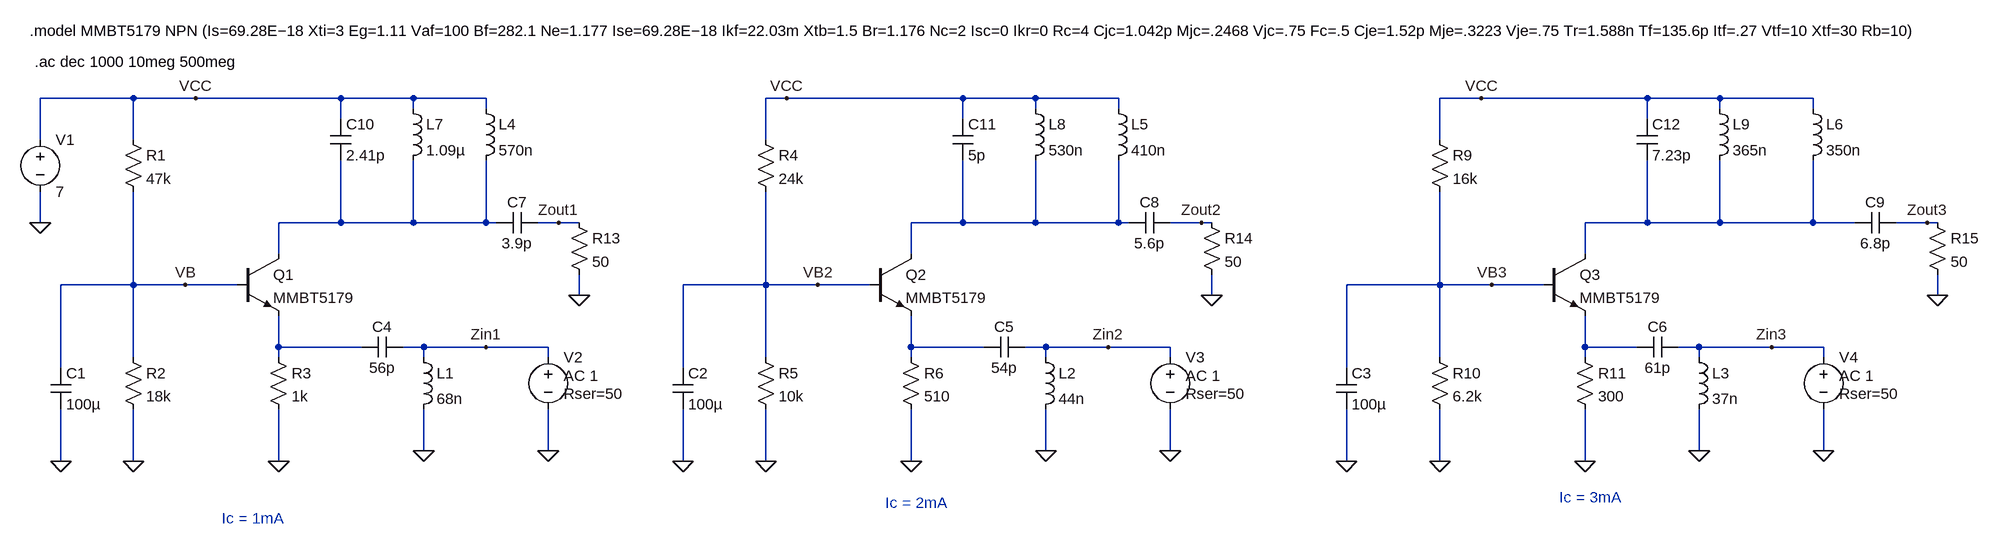
[diagram p0: schematic 7_Image_Filter.asc]
7_Image_Filter.asc, the LTspice schematic file:
Version 4
SHEET 1 1332 680
WIRE -2336 -2128 -2480 -2128
WIRE -2240 -2128 -2336 -2128
WIRE -2016 -2128 -2240 -2128
WIRE -1904 -2128 -2016 -2128
WIRE -1792 -2128 -1904 -2128
WIRE -1328 -2128 -1360 -2128
WIRE -1056 -2128 -1328 -2128
WIRE -944 -2128 -1056 -2128
WIRE -816 -2128 -944 -2128
WIRE -256 -2128 -320 -2128
WIRE 0 -2128 -256 -2128
WIRE 112 -2128 0 -2128
WIRE 256 -2128 112 -2128
WIRE -1904 -2112 -1904 -2128
WIRE -1792 -2112 -1792 -2128
WIRE -944 -2112 -944 -2128
WIRE -816 -2112 -816 -2128
WIRE 112 -2112 112 -2128
WIRE 256 -2112 256 -2128
WIRE -2016 -2096 -2016 -2128
WIRE -1056 -2096 -1056 -2128
WIRE 0 -2096 0 -2128
WIRE -2480 -2064 -2480 -2128
WIRE -2336 -2064 -2336 -2128
WIRE -1360 -2064 -1360 -2128
WIRE -320 -2064 -320 -2128
WIRE -2480 -1936 -2480 -1984
WIRE -2016 -1936 -2016 -2032
WIRE -2016 -1936 -2112 -1936
WIRE -1904 -1936 -1904 -2032
WIRE -1904 -1936 -2016 -1936
WIRE -1792 -1936 -1792 -2032
WIRE -1792 -1936 -1904 -1936
WIRE -1776 -1936 -1792 -1936
WIRE -1680 -1936 -1712 -1936
WIRE -1648 -1936 -1680 -1936
WIRE -1056 -1936 -1056 -2032
WIRE -1056 -1936 -1136 -1936
WIRE -944 -1936 -944 -2032
WIRE -944 -1936 -1056 -1936
WIRE -816 -1936 -816 -2032
WIRE -816 -1936 -944 -1936
WIRE -800 -1936 -816 -1936
WIRE -688 -1936 -736 -1936
WIRE -672 -1936 -688 -1936
WIRE 0 -1936 0 -2032
WIRE 0 -1936 -96 -1936
WIRE 112 -1936 112 -2032
WIRE 112 -1936 0 -1936
WIRE 256 -1936 256 -2032
WIRE 256 -1936 112 -1936
WIRE 320 -1936 256 -1936
WIRE 432 -1936 384 -1936
WIRE 448 -1936 432 -1936
WIRE -2112 -1888 -2112 -1936
WIRE -1136 -1888 -1136 -1936
WIRE -96 -1888 -96 -1936
WIRE -2336 -1840 -2336 -1984
WIRE -2336 -1840 -2448 -1840
WIRE -2256 -1840 -2336 -1840
WIRE -2176 -1840 -2256 -1840
WIRE -1360 -1840 -1360 -1984
WIRE -1360 -1840 -1488 -1840
WIRE -1280 -1840 -1360 -1840
WIRE -1200 -1840 -1280 -1840
WIRE -320 -1840 -320 -1984
WIRE -320 -1840 -464 -1840
WIRE -240 -1840 -320 -1840
WIRE -160 -1840 -240 -1840
WIRE -1648 -1824 -1648 -1856
WIRE -672 -1824 -672 -1856
WIRE 448 -1824 448 -1856
WIRE -2112 -1744 -2112 -1792
WIRE -1984 -1744 -2112 -1744
WIRE -1888 -1744 -1920 -1744
WIRE -1792 -1744 -1888 -1744
WIRE -1696 -1744 -1792 -1744
WIRE -1136 -1744 -1136 -1792
WIRE -1024 -1744 -1136 -1744
WIRE -928 -1744 -960 -1744
WIRE -832 -1744 -928 -1744
WIRE -736 -1744 -832 -1744
WIRE -96 -1744 -96 -1792
WIRE -16 -1744 -96 -1744
WIRE 80 -1744 48 -1744
WIRE 192 -1744 80 -1744
WIRE 272 -1744 192 -1744
WIRE -2336 -1728 -2336 -1840
WIRE -2112 -1728 -2112 -1744
WIRE -1888 -1728 -1888 -1744
WIRE -1696 -1728 -1696 -1744
WIRE -1360 -1728 -1360 -1840
WIRE -1136 -1728 -1136 -1744
WIRE -928 -1728 -928 -1744
WIRE -736 -1728 -736 -1744
WIRE -320 -1728 -320 -1840
WIRE -96 -1728 -96 -1744
WIRE 80 -1728 80 -1744
WIRE 272 -1728 272 -1744
WIRE -2448 -1712 -2448 -1840
WIRE -1488 -1712 -1488 -1840
WIRE -464 -1712 -464 -1840
WIRE -1888 -1584 -1888 -1648
WIRE -1696 -1584 -1696 -1648
WIRE -928 -1584 -928 -1648
WIRE -736 -1584 -736 -1648
WIRE 80 -1584 80 -1648
WIRE 272 -1584 272 -1648
WIRE -2448 -1568 -2448 -1648
WIRE -2336 -1568 -2336 -1648
WIRE -2112 -1568 -2112 -1648
WIRE -1488 -1568 -1488 -1648
WIRE -1360 -1568 -1360 -1648
WIRE -1136 -1568 -1136 -1648
WIRE -464 -1568 -464 -1648
WIRE -320 -1568 -320 -1648
WIRE -96 -1568 -96 -1648
FLAG -2480 -1936 0
FLAG -2336 -1568 0
FLAG -2112 -1568 0
FLAG -2256 -1840 VB
FLAG -2240 -2128 VCC
FLAG -2448 -1568 0
FLAG -1360 -1568 0
FLAG -1136 -1568 0
FLAG -1280 -1840 VB2
FLAG -1328 -2128 VCC
FLAG -1488 -1568 0
FLAG -320 -1568 0
FLAG -96 -1568 0
FLAG -240 -1840 VB3
FLAG -464 -1568 0
FLAG -256 -2128 VCC
FLAG -1696 -1584 0
FLAG -1888 -1584 0
FLAG -736 -1584 0
FLAG -928 -1584 0
FLAG 272 -1584 0
FLAG 80 -1584 0
FLAG -1792 -1744 Zin1
FLAG -832 -1744 Zin2
FLAG 192 -1744 Zin3
FLAG -1648 -1824 0
FLAG -672 -1824 0
FLAG 448 -1824 0
FLAG -1680 -1936 Zout1
FLAG -688 -1936 Zout2
FLAG 432 -1936 Zout3
SYMBOL res -2352 -2080 R0
SYMATTR InstName R1
SYMATTR Value 47k
SYMBOL res -2352 -1744 R0
SYMATTR InstName R2
SYMATTR Value 18k
SYMBOL res -2128 -1744 R0
SYMATTR InstName R3
SYMATTR Value 1k
SYMBOL voltage -2480 -2080 R0
WINDOW 123 0 0 Left 0
WINDOW 39 0 0 Left 0
SYMATTR InstName V1
SYMATTR Value 7
SYMBOL npn -2176 -1888 R0
SYMATTR InstName Q1
SYMATTR Value MMBT5179
SYMBOL cap -2464 -1712 R0
SYMATTR InstName C1
SYMATTR Value 100µ
SYMBOL res -1376 -2080 R0
SYMATTR InstName R4
SYMATTR Value 24k
SYMBOL res -1376 -1744 R0
SYMATTR InstName R5
SYMATTR Value 10k
SYMBOL res -1152 -1744 R0
SYMATTR InstName R6
SYMATTR Value 510
SYMBOL npn -1200 -1888 R0
SYMATTR InstName Q2
SYMATTR Value MMBT5179
SYMBOL cap -1504 -1712 R0
SYMATTR InstName C2
SYMATTR Value 100µ
SYMBOL res -336 -2080 R0
SYMATTR InstName R9
SYMATTR Value 16k
SYMBOL res -336 -1744 R0
SYMATTR InstName R10
SYMATTR Value 6.2k
SYMBOL res -112 -1744 R0
SYMATTR InstName R11
SYMATTR Value 300
SYMBOL npn -160 -1888 R0
SYMATTR InstName Q3
SYMATTR Value MMBT5179
SYMBOL cap -480 -1712 R0
SYMATTR InstName C3
SYMATTR Value 100µ
SYMBOL cap -1920 -1760 R90
WINDOW 0 0 32 VBottom 2
WINDOW 3 32 32 VTop 2
SYMATTR InstName C4
SYMATTR Value 56p
SYMBOL ind -1904 -1744 R0
SYMATTR InstName L1
SYMATTR Value 68n
SYMBOL cap -960 -1760 R90
WINDOW 0 0 32 VBottom 2
WINDOW 3 32 32 VTop 2
SYMATTR InstName C5
SYMATTR Value 54p
SYMBOL ind -944 -1744 R0
SYMATTR InstName L2
SYMATTR Value 44n
SYMBOL cap 48 -1760 R90
WINDOW 0 0 32 VBottom 2
WINDOW 3 32 32 VTop 2
SYMATTR InstName C6
SYMATTR Value 61p
SYMBOL ind 64 -1744 R0
SYMATTR InstName L3
SYMATTR Value 37n
SYMBOL res -1664 -1952 R0
SYMATTR InstName R13
SYMATTR Value 50
SYMBOL res -688 -1952 R0
SYMATTR InstName R14
SYMATTR Value 50
SYMBOL res 432 -1952 R0
SYMATTR InstName R15
SYMATTR Value 50
SYMBOL cap -1712 -1952 R90
WINDOW 0 0 32 VBottom 2
WINDOW 3 32 32 VTop 2
SYMATTR InstName C7
SYMATTR Value 3.9p
SYMBOL cap -736 -1952 R90
WINDOW 0 0 32 VBottom 2
WINDOW 3 32 32 VTop 2
SYMATTR InstName C8
SYMATTR Value 5.6p
SYMBOL cap 384 -1952 R90
WINDOW 0 0 32 VBottom 2
WINDOW 3 32 32 VTop 2
SYMATTR InstName C9
SYMATTR Value 6.8p
SYMBOL ind -1808 -2128 R0
SYMATTR InstName L4
SYMATTR Value 570n
SYMBOL ind -832 -2128 R0
SYMATTR InstName L5
SYMATTR Value 410n
SYMBOL ind 240 -2128 R0
SYMATTR InstName L6
SYMATTR Value 350n
SYMBOL ind -1920 -2128 R0
SYMATTR InstName L7
SYMATTR Value 1.09µ
SYMBOL cap -2032 -2096 R0
SYMATTR InstName C10
SYMATTR Value 2.41p
SYMBOL ind -960 -2128 R0
SYMATTR InstName L8
SYMATTR Value 530n
SYMBOL cap -1072 -2096 R0
SYMATTR InstName C11
SYMATTR Value 5p
SYMBOL ind 96 -2128 R0
SYMATTR InstName L9
SYMATTR Value 365n
SYMBOL cap -16 -2096 R0
SYMATTR InstName C12
SYMATTR Value 7.23p
SYMBOL voltage -1696 -1744 R0
WINDOW 123 24 44 Left 2
WINDOW 39 24 72 Left 2
SYMATTR InstName V2
SYMATTR Value ""
SYMATTR Value2 AC 1
SYMATTR SpiceLine Rser=50
SYMBOL voltage -736 -1744 R0
WINDOW 123 24 44 Left 2
WINDOW 39 24 72 Left 2
SYMATTR InstName V3
SYMATTR Value ""
SYMATTR Value2 AC 1
SYMATTR SpiceLine Rser=50
SYMBOL voltage 272 -1744 R0
WINDOW 123 24 44 Left 2
WINDOW 39 24 72 Left 2
SYMATTR InstName V4
SYMATTR Value ""
SYMATTR Value2 AC 1
SYMATTR SpiceLine Rser=50
TEXT -2496 -2232 Left 2 !.model MMBT5179 NPN (Is=69.28E−18 Xti=3 Eg=1.11 Vaf=100 Bf=282.1 Ne=1.177 Ise=69.28E−18 Ikf=22.03m Xtb=1.5 Br=1.176 Nc=2 Isc=0 Ikr=0 Rc=4 Cjc=1.042p Mjc=.2468 Vjc=.75 Fc=.5 Cje=1.52p Mje=.3223 Vje=.75 Tr=1.588n Tf=135.6p Itf=.27 Vtf=10 Xtf=30 Rb=10)
TEXT -2488 -2184 Left 2 !.ac dec 1000 10meg 500meg
TEXT -2200 -1480 Left 2 ;Ic = 1mA
TEXT -1176 -1504 Left 2 ;Ic = 2mA
TEXT -136 -1512 Left 2 ;Ic = 3mA

The netlist it stands for:
* 7_Image_Filter.asc
R1 VCC VB 47k
R2 VB 0 18k
R3 N004 0 1k
V1 VCC 0 7
Q1 N001 VB N004 0 MMBT5179
C1 VB 0 100µ
R4 VCC VB2 24k
R5 VB2 0 10k
R6 N005 0 510
Q2 N002 VB2 N005 0 MMBT5179
C2 VB2 0 100µ
R9 VCC VB3 16k
R10 VB3 0 6.2k
R11 N006 0 300
Q3 N003 VB3 N006 0 MMBT5179
C3 VB3 0 100µ
C4 Zin1 N004 56p
L1 Zin1 0 68n
C5 Zin2 N005 54p
L2 Zin2 0 44n
C6 Zin3 N006 61p
L3 Zin3 0 37n
R13 Zout1 0 50
R14 Zout2 0 50
R15 Zout3 0 50
C7 Zout1 N001 3.9p
C8 Zout2 N002 5.6p
C9 Zout3 N003 6.8p
L4 VCC N001 570n
L5 VCC N002 410n
L6 VCC N003 350n
L7 VCC N001 1.09µ
C10 VCC N001 2.41p
L8 VCC N002 530n
C11 VCC N002 5p
L9 VCC N003 365n
C12 VCC N003 7.23p
V2 Zin1 0 AC 1 Rser=50
V3 Zin2 0 AC 1 Rser=50
V4 Zin3 0 AC 1 Rser=50
.model NPN NPN
.model PNP PNP
.lib standard.bjt
.model MMBT5179 NPN (Is=69.28E−18 Xti=3 Eg=1.11 Vaf=100 Bf=282.1 Ne=1.177 Ise=69.28E−18 Ikf=22.03m Xtb=1.5 Br=1.176 Nc=2 Isc=0 Ikr=0 Rc=4 Cjc=1.042p Mjc=.2468 Vjc=.75 Fc=.5 Cje=1.52p Mje=.3223 Vje=.75 Tr=1.588n Tf=135.6p Itf=.27 Vtf=10 Xtf=30 Rb=10)
.ac dec 1000 10meg 500meg
* Ic = 1mA
* Ic = 2mA
* Ic = 3mA
.backanno
.end